# Altium schematic sheet CATS-EUROC-Frontend.SchDoc: CATS EuRoC Edition
size A4; Author: Luca Jost; Revision: V1.0; SheetNumber: 15; SheetTotal: 16; Subtitle: Front End
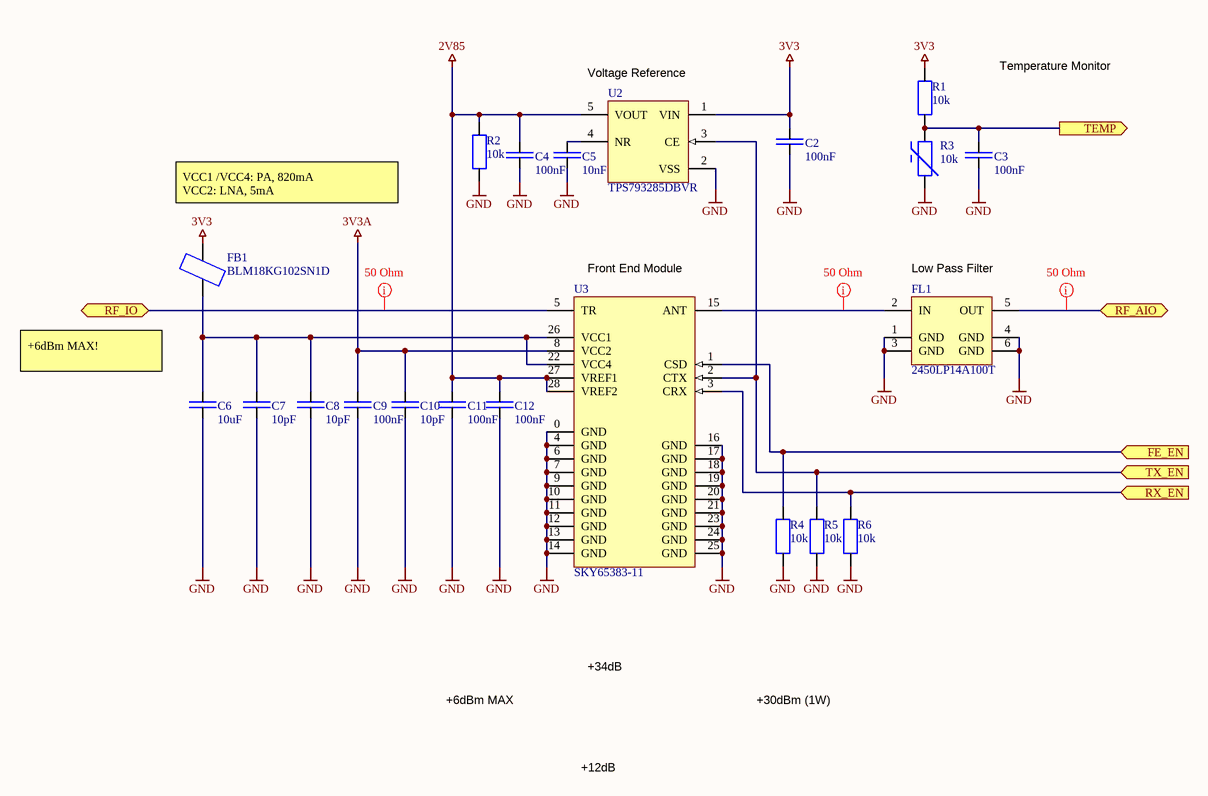
[diagram p0: CATS-EUROC-Frontend.SchDoc]

## Parts
C2  100nF  [SMD Keramikkondensator 0402]
C3  100nF  [SMD Keramikkondensator 0402]
C4  100nF  [SMD Keramikkondensator 0402]
C5  10nF  [SMD Keramikkondensator 0402]
C6  10uF  [SMD Keramikkondensator 0603]
C7  10pF  [SMD Keramikkondensator 0402]
C8  10pF  [SMD Keramikkondensator 0402]
C9  100nF  [SMD Keramikkondensator 0402]
C10  10pF  [SMD Keramikkondensator 0402]
C11  100nF  [SMD Keramikkondensator 0402]
C12  100nF  [SMD Keramikkondensator 0402]
FB1  BLM18KG102SN1D  [SMD Ferrite Bead 0603]
FL1  2450LP14A100T  [SMD Filter 2450LP14A100T]
R1  10k  [SMD Widerstand 0402]
R2  10k  [SMD Widerstand 0402]
R3  10k  [SMD Ferrite Bead 0402]
R4  10k  [SMD Widerstand 0402]
R5  10k  [SMD Widerstand 0402]
R6  10k  [SMD Widerstand 0402]
U2  TPS793285DBVR  [SMD IC SOT-23-5]
U3  SKY65383-11  [SMD IC 28-MCM]

## Ports
FE_EN (in), RF_AIO (bidir), RF_IO (bidir), RX_EN (in), TEMP (out), TX_EN (in)

## Nets
2V85: C4.2 C11.2 C12.2 R2.2 U2.5(VOUT) U3.27(VREF1) U3.28(VREF2)
3V3: C2.2 FB1.2 R1.2 U2.1(VIN)
3V3A: C9.2 C10.2 U3.8(VCC2)
GND: C2.1 C3.1 C4.1 C5.1 C6.1 C7.1 C8.1 C9.1 C10.1 C11.1 C12.1 FL1.1(GND) FL1.3(GND) FL1.4(GND) FL1.6(GND) R2.1 R3.2 R4.1 R5.1 R6.1 U2.2(VSS) U3.0(GND) U3.4(GND) U3.6(GND) U3.7(GND) U3.9(GND) U3.10(GND) U3.11(GND) U3.12(GND) U3.13(GND) U3.14(GND) U3.16(GND) U3.17(GND) U3.18(GND) U3.19(GND) U3.20(GND) U3.21(GND) U3.23(GND) U3.24(GND) U3.25(GND)
FE_EN: R4.2 U3.1(CSD) ; port FE_EN
RF_AIO: FL1.5(OUT) ; port RF_AIO
RF_IO: U3.5(TR) ; port RF_IO
RX_EN: R6.2 U3.3(CRX) ; port RX_EN
TEMP: C3.2 R1.1 R3.1 ; port TEMP
TX_EN: R5.2 U2.3(CE) U3.2(CTX) ; port TX_EN
NetC5_2: C5.2 U2.4(NR)
NetC6_2: C6.2 C7.2 C8.2 FB1.1 U3.22(VCC4) U3.26(VCC1)
NetFL1_2: FL1.2(IN) U3.15(ANT)

## Layout directives
rule Impedance Constraint [Min = 50.00    Max = 50.00    ]; net class RF-Line 50: NetFL1_2, RF_AIO, RF_IO

## Notes on the sheet
- (near U2) Voltage Reference
- Temperature Monitor
- VCC1 /VCC4: PA, 820mA
  VCC2: LNA, 5mA
- (near U3) Front End Module
- (near FL1) Low Pass Filter
- +6dBm MAX!
- +6dBm MAX
- +34dB
- +30dBm (1W)
- +12dB
- Title
- Author:
- Subtitle
- Date:
- Rev:
- File:
- Sheet
- of

## Library data of the parts
C2-C4 C9 C11 C12 = E6 - 100nF: SMD Ceramic Capacitor E6; Unit Price: 0.01; Number: -; Supplier: -; JLC: C307331
C5 = E6 - 10nF: SMD Ceramic Capacitor E6; Unit Price: 0.01; Number: -; Supplier: -; JLC: C15195
C6 = E6 - 10uF: SMD Ceramic Capacitor E6; Unit Price: 0.01; Number: -; Supplier: -; JLC: C96446
C7 C8 C10 = E6 - 10pF: SMD Ceramic Capacitor E6; Unit Price: 0.01; Number: -; Supplier: -; JLC: C32949
FB1 = BLM18KG102SN1D: 1 kOhms @ 100MHz 1 Power Line Ferrite Bead 0603 (1608 Metric) 1A 200mOhm; ComponentLink1Description: Datasheet; ComponentLink1URL: https://www.murata.com/en-us/products/productdata/8796738650142/ENFA0003.pdf; Digikey: 490-17349-1-ND; JLC: C42102
FL1 = 2450LP14A100T: 2.45GHz Center Frequency Low Pass RF Filter (Radio Frequency) 100MHz Bandwidth 0.5dB 0603 (1608 Metric), 6 PC Pad; ComponentLink1Description: Datasheet; ComponentLink1URL: https://www.johansontechnology.com/datasheets/2450LP14A100/2450LP14A100.pdf; Digikey: 712-1129-2-ND
R1 R2 R4-R6 = E24 - 10k: SMD Chip Resistor E24; Unit Price: 0.01; Number: -; Supplier: -; JLC: C25744
R3 = NCU15XH103F6SRC: 10kΩ -40℃~+125℃ 3455K 0.1mA 3434K ±1% 3380K ±1% 0402 NTC Thermistors; ComponentLink1Description: Datasheet; ComponentLink1URL: https://datasheet.lcsc.com/lcsc/1912111437_Murata-Electronics-NCU15XH103F6SRC_C333993.pdf; JLC: C333993
U2 = TPS793285DBVR: Linear Voltage Regulator IC Positive Fixed 1 Output  200mA SOT-23-5 2.85V; ComponentLink1Description: Datasheet; ComponentLink1URL: https://media.digikey.com/pdf/Data%20Sheets/Texas%20Instruments%20PDFs/TPS793_Rev2015.pdf; Digikey: 296-12157-1-ND
U3 = SKY65383-11: 2400 to 2483 MHz Transmit/Receive / Front-End Module +30dBm; ComponentLink1Description: Datasheet; ComponentLink1URL: https://www.skyworksinc.com/-/media/SkyWorks/Documents/Products/2901-3000/SKY65383-11_202668G.pdf; Digikey: 863-1798-1-ND